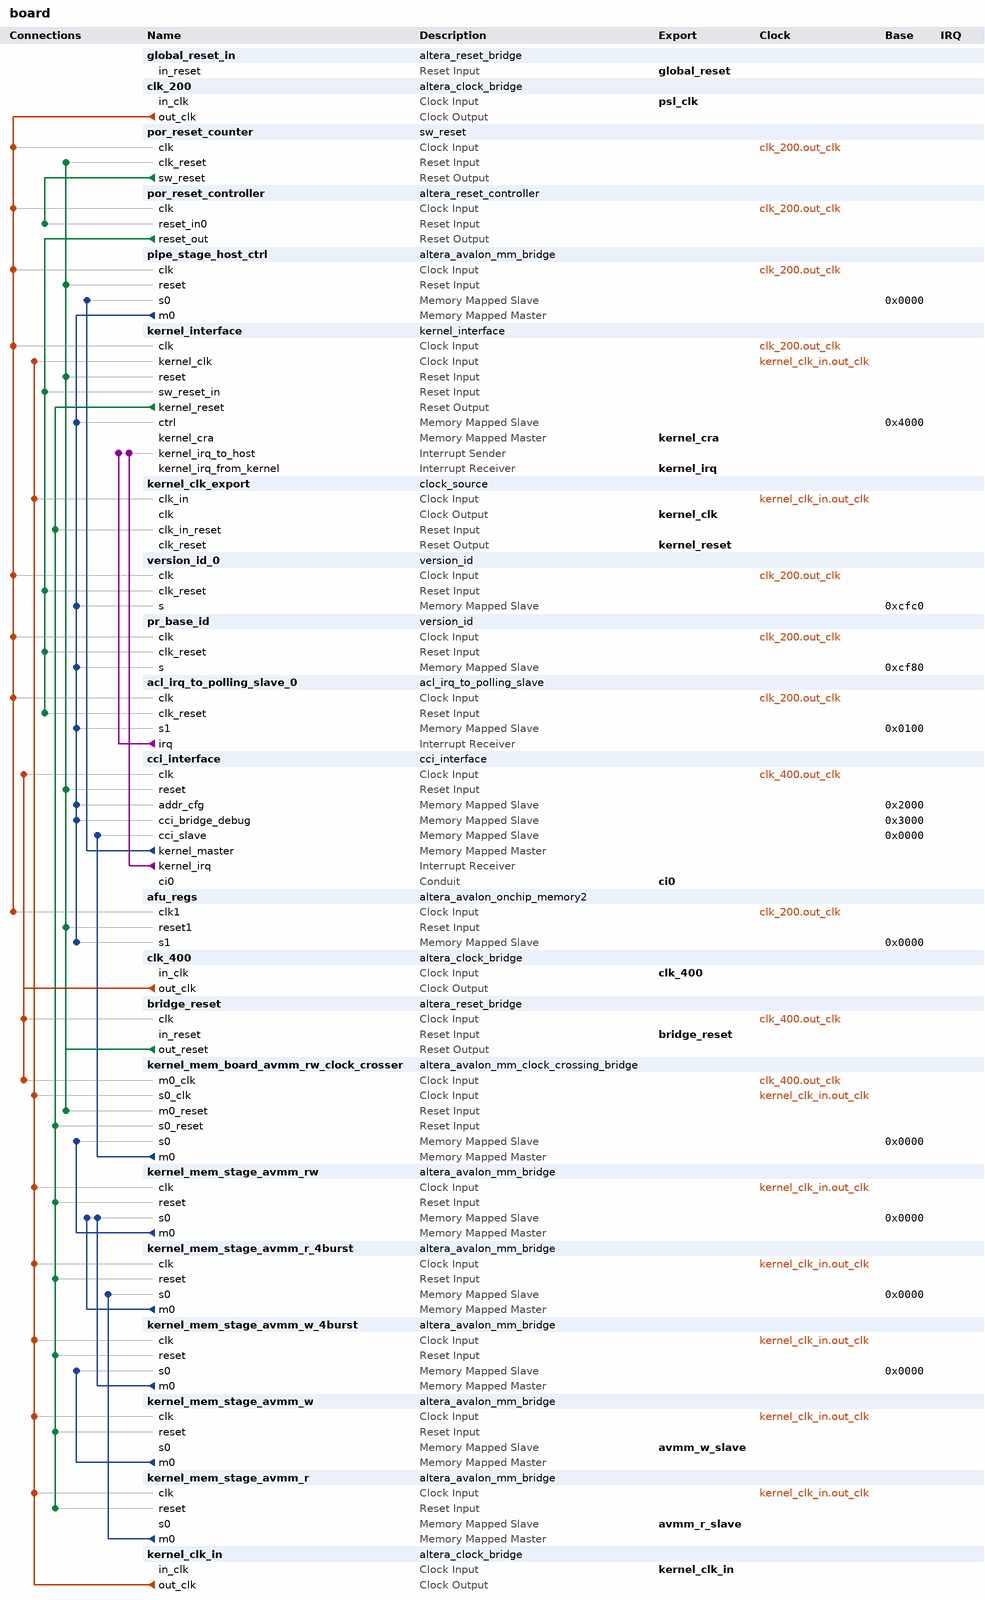
[diagram p0: system contents]
# Platform Designer (Qsys) system board, Arria 10 10AX115N3F40E2SG
# Parameters at their usual value, and those the tool derives, are not listed.
package require -exact qsys 1.0
create_system board
set_project_property DEVICE_FAMILY {Arria 10}
set_project_property DEVICE 10AX115N3F40E2SG

add_component global_reset_in ip/board/board_global_reset_in.ip altera_reset_bridge global_reset_in 17.0

add_component clk_200 ip/board/board_clk_200.ip altera_clock_bridge clk_200 17.0

add_component por_reset_counter ip/board/board_por_reset_counter.ip sw_reset por_reset_counter 10.0

add_component por_reset_controller ip/board/board_por_reset_controller.ip altera_reset_controller por_reset_controller 17.0
load_component por_reset_controller
set_component_parameter_value NUM_RESET_INPUTS 1
set_component_parameter_value SYNC_DEPTH 2
set_component_parameter_value ADAPT_RESET_REQUEST 0
save_component

add_component pipe_stage_host_ctrl ip/board/board_pipe_stage_host_ctrl.ip altera_avalon_mm_bridge pipe_stage_host_ctrl 17.0

add_component kernel_interface ip/board/board_kernel_interface.ip kernel_interface kernel_interface 15.1

add_component kernel_clk_export ip/board/board_kernel_clk_export.ip clock_source kernel_clk_export 
load_component kernel_clk_export
set_component_parameter_value clockFrequency 50000000
set_component_parameter_value clockFrequencyKnown false
set_component_parameter_value resetSynchronousEdges DEASSERT
save_component

add_component version_id_0 ip/board/board_version_id_0.ip version_id version_id_0 10.0
load_component version_id_0
set_component_parameter_value WIDTH 32
set_component_parameter_value VERSION_ID 1298131504
save_component

add_component pr_base_id ip/board/board_pr_base_id.ip version_id pr_base_id 10.0
load_component pr_base_id
set_component_parameter_value WIDTH 32
set_component_parameter_value VERSION_ID 1284905767
save_component

add_component acl_irq_to_polling_slave_0 ip/board/board_acl_irq_to_polling_slave_0.ip acl_irq_to_polling_slave acl_irq_to_polling_slave_0 10.0

add_instance cci_interface cci_interface 1.0

add_component afu_regs ip/board/board_afu_regs.ip altera_avalon_onchip_memory2 afu_regs 17.0
load_component afu_regs
set_component_parameter_value blockType M20K
set_component_parameter_value dataWidth 64
set_component_parameter_value dualPort false
set_component_parameter_value initMemContent true
set_component_parameter_value initializationFileName afuregs.hex
set_component_parameter_value memorySize 64
set_component_parameter_value useNonDefaultInitFile true
set_component_parameter_value writable false
set_component_parameter_value resetrequest_enabled false
save_component

add_component clk_400 ip/board/board_clk_400.ip altera_clock_bridge clk_400 17.0
load_component clk_400
set_component_parameter_value DERIVED_CLOCK_RATE 0
set_component_parameter_value EXPLICIT_CLOCK_RATE 200
save_component

add_component bridge_reset ip/board/board_bridge_reset.ip altera_reset_bridge bridge_reset 17.0

add_component kernel_mem_board_avmm_rw_clock_crosser ip/board/board_kernel_mem_board_avmm_rw_clock_crosser.ip altera_avalon_mm_clock_crossing_bridge kernel_mem_board_avmm_rw_clock_crosser 17.0

add_component kernel_mem_stage_avmm_rw ip/board/board_kernel_mem_stage_avmm_rw.ip altera_avalon_mm_bridge kernel_mem_stage_avmm_rw 17.0

add_component kernel_mem_stage_avmm_r_4burst ip/board/board_kernel_mem_stage_avmm_r_4burst.ip altera_avalon_mm_bridge kernel_mem_stage_avmm_r_4burst 17.0

add_component kernel_mem_stage_avmm_w_4burst ip/board/board_kernel_mem_stage_avmm_w_4burst.ip altera_avalon_mm_bridge kernel_mem_stage_avmm_w_4burst 17.0

add_component kernel_mem_stage_avmm_w ip/board/board_kernel_mem_stage_avmm_w.ip altera_avalon_mm_bridge kernel_mem_stage_avmm_w 17.0

add_component kernel_mem_stage_avmm_r ip/board/board_kernel_mem_stage_avmm_r.ip altera_avalon_mm_bridge kernel_mem_stage_avmm_r 17.0
load_component kernel_mem_stage_avmm_r
set_component_parameter_value DATA_WIDTH 512
set_component_parameter_value ADDRESS_WIDTH 64
set_component_parameter_value USE_AUTO_ADDRESS_WIDTH 0
set_component_parameter_value ADDRESS_UNITS SYMBOLS
set_component_parameter_value MAX_BURST_SIZE 16
set_component_parameter_value MAX_PENDING_RESPONSES 512
save_component

add_component kernel_clk_in ip/board/board_kernel_clk_in.ip altera_clock_bridge kernel_clk_in 17.0

# connections
add_connection clk_200.out_clk acl_irq_to_polling_slave_0.clk clock
add_connection clk_200.out_clk afu_regs.clk1 clock
add_connection clk_200.out_clk kernel_interface.clk clock
add_connection clk_200.out_clk pipe_stage_host_ctrl.clk clock
add_connection clk_200.out_clk por_reset_controller.clk clock
add_connection clk_200.out_clk por_reset_counter.clk clock
add_connection clk_200.out_clk pr_base_id.clk clock
add_connection clk_200.out_clk version_id_0.clk clock
add_connection clk_400.out_clk bridge_reset.clk clock
add_connection clk_400.out_clk cci_interface.clk clock
add_connection clk_400.out_clk kernel_mem_board_avmm_rw_clock_crosser.m0_clk clock
add_connection kernel_clk_in.out_clk kernel_clk_export.clk_in clock
add_connection kernel_clk_in.out_clk kernel_interface.kernel_clk clock
add_connection kernel_clk_in.out_clk kernel_mem_board_avmm_rw_clock_crosser.s0_clk clock
add_connection kernel_clk_in.out_clk kernel_mem_stage_avmm_r.clk clock
add_connection kernel_clk_in.out_clk kernel_mem_stage_avmm_r_4burst.clk clock
add_connection kernel_clk_in.out_clk kernel_mem_stage_avmm_rw.clk clock
add_connection kernel_clk_in.out_clk kernel_mem_stage_avmm_w.clk clock
add_connection kernel_clk_in.out_clk kernel_mem_stage_avmm_w_4burst.clk clock
add_connection bridge_reset.out_reset afu_regs.reset1 reset
add_connection bridge_reset.out_reset cci_interface.reset reset
add_connection bridge_reset.out_reset kernel_interface.reset reset
add_connection bridge_reset.out_reset kernel_mem_board_avmm_rw_clock_crosser.m0_reset reset
add_connection bridge_reset.out_reset pipe_stage_host_ctrl.reset reset
add_connection bridge_reset.out_reset por_reset_counter.clk_reset reset
add_connection kernel_interface.kernel_reset kernel_clk_export.clk_in_reset reset
add_connection kernel_interface.kernel_reset kernel_mem_board_avmm_rw_clock_crosser.s0_reset reset
add_connection kernel_interface.kernel_reset kernel_mem_stage_avmm_r.reset reset
add_connection kernel_interface.kernel_reset kernel_mem_stage_avmm_r_4burst.reset reset
add_connection kernel_interface.kernel_reset kernel_mem_stage_avmm_rw.reset reset
add_connection kernel_interface.kernel_reset kernel_mem_stage_avmm_w.reset reset
add_connection kernel_interface.kernel_reset kernel_mem_stage_avmm_w_4burst.reset reset
add_connection por_reset_controller.reset_out acl_irq_to_polling_slave_0.clk_reset reset
add_connection por_reset_controller.reset_out kernel_interface.sw_reset_in reset
add_connection por_reset_controller.reset_out pr_base_id.clk_reset reset
add_connection por_reset_controller.reset_out version_id_0.clk_reset reset
add_connection por_reset_counter.sw_reset por_reset_controller.reset_in0 reset
add_connection cci_interface.kernel_master pipe_stage_host_ctrl.s0 avalon
set_connection_parameter_value cci_interface.kernel_master/pipe_stage_host_ctrl.s0 baseAddress 0x0000
add_connection kernel_mem_board_avmm_rw_clock_crosser.m0 cci_interface.cci_slave avalon
set_connection_parameter_value kernel_mem_board_avmm_rw_clock_crosser.m0/cci_interface.cci_slave baseAddress 0x0000
add_connection kernel_mem_stage_avmm_r.m0 kernel_mem_stage_avmm_r_4burst.s0 avalon
set_connection_parameter_value kernel_mem_stage_avmm_r.m0/kernel_mem_stage_avmm_r_4burst.s0 baseAddress 0x0000
add_connection kernel_mem_stage_avmm_r_4burst.m0 kernel_mem_stage_avmm_rw.s0 avalon
set_connection_parameter_value kernel_mem_stage_avmm_r_4burst.m0/kernel_mem_stage_avmm_rw.s0 baseAddress 0x0000
add_connection kernel_mem_stage_avmm_rw.m0 kernel_mem_board_avmm_rw_clock_crosser.s0 avalon
set_connection_parameter_value kernel_mem_stage_avmm_rw.m0/kernel_mem_board_avmm_rw_clock_crosser.s0 baseAddress 0x0000
add_connection kernel_mem_stage_avmm_w.m0 kernel_mem_stage_avmm_w_4burst.s0 avalon
set_connection_parameter_value kernel_mem_stage_avmm_w.m0/kernel_mem_stage_avmm_w_4burst.s0 baseAddress 0x0000
add_connection kernel_mem_stage_avmm_w_4burst.m0 kernel_mem_stage_avmm_rw.s0 avalon
set_connection_parameter_value kernel_mem_stage_avmm_w_4burst.m0/kernel_mem_stage_avmm_rw.s0 baseAddress 0x0000
add_connection pipe_stage_host_ctrl.m0 acl_irq_to_polling_slave_0.s1 avalon
set_connection_parameter_value pipe_stage_host_ctrl.m0/acl_irq_to_polling_slave_0.s1 baseAddress 0x0100
add_connection pipe_stage_host_ctrl.m0 afu_regs.s1 avalon
set_connection_parameter_value pipe_stage_host_ctrl.m0/afu_regs.s1 baseAddress 0x0000
add_connection pipe_stage_host_ctrl.m0 cci_interface.addr_cfg avalon
set_connection_parameter_value pipe_stage_host_ctrl.m0/cci_interface.addr_cfg baseAddress 0x2000
add_connection pipe_stage_host_ctrl.m0 cci_interface.cci_bridge_debug avalon
set_connection_parameter_value pipe_stage_host_ctrl.m0/cci_interface.cci_bridge_debug baseAddress 0x3000
add_connection pipe_stage_host_ctrl.m0 kernel_interface.ctrl avalon
set_connection_parameter_value pipe_stage_host_ctrl.m0/kernel_interface.ctrl baseAddress 0x4000
add_connection pipe_stage_host_ctrl.m0 pr_base_id.s avalon
set_connection_parameter_value pipe_stage_host_ctrl.m0/pr_base_id.s baseAddress 0xcf80
add_connection pipe_stage_host_ctrl.m0 version_id_0.s avalon
set_connection_parameter_value pipe_stage_host_ctrl.m0/version_id_0.s baseAddress 0xcfc0
add_connection acl_irq_to_polling_slave_0.irq kernel_interface.kernel_irq_to_host interrupt
add_connection cci_interface.kernel_irq kernel_interface.kernel_irq_to_host interrupt

# exported interfaces
add_interface avmm_r_slave avalon slave
set_interface_property avmm_r_slave EXPORT_OF kernel_mem_stage_avmm_r.s0
add_interface avmm_w_slave avalon slave
set_interface_property avmm_w_slave EXPORT_OF kernel_mem_stage_avmm_w.s0
add_interface bridge_reset reset sink
set_interface_property bridge_reset EXPORT_OF bridge_reset.in_reset
add_interface ci0 conduit end
set_interface_property ci0 EXPORT_OF cci_interface.ci0
add_interface clk_400 clock sink
set_interface_property clk_400 EXPORT_OF clk_400.in_clk
add_interface global_reset reset sink
set_interface_property global_reset EXPORT_OF global_reset_in.in_reset
add_interface kernel_clk clock source
set_interface_property kernel_clk EXPORT_OF kernel_clk_export.clk
add_interface kernel_clk_in clock sink
set_interface_property kernel_clk_in EXPORT_OF kernel_clk_in.in_clk
add_interface kernel_cra avalon master
set_interface_property kernel_cra EXPORT_OF kernel_interface.kernel_cra
add_interface kernel_irq interrupt receiver
set_interface_property kernel_irq EXPORT_OF kernel_interface.kernel_irq_from_kernel
add_interface kernel_reset reset source
set_interface_property kernel_reset EXPORT_OF kernel_clk_export.clk_reset
add_interface psl_clk clock sink
set_interface_property psl_clk EXPORT_OF clk_200.in_clk

set_interconnect_requirement {$system} qsys_mm.clockCrossingAdapter FIFO
set_interconnect_requirement {$system} qsys_mm.maxAdditionalLatency 4

save_system board.qsys
